# EAGLE design nixie_main_controller_board_0.2.3 (EAGLE 6.5.0)
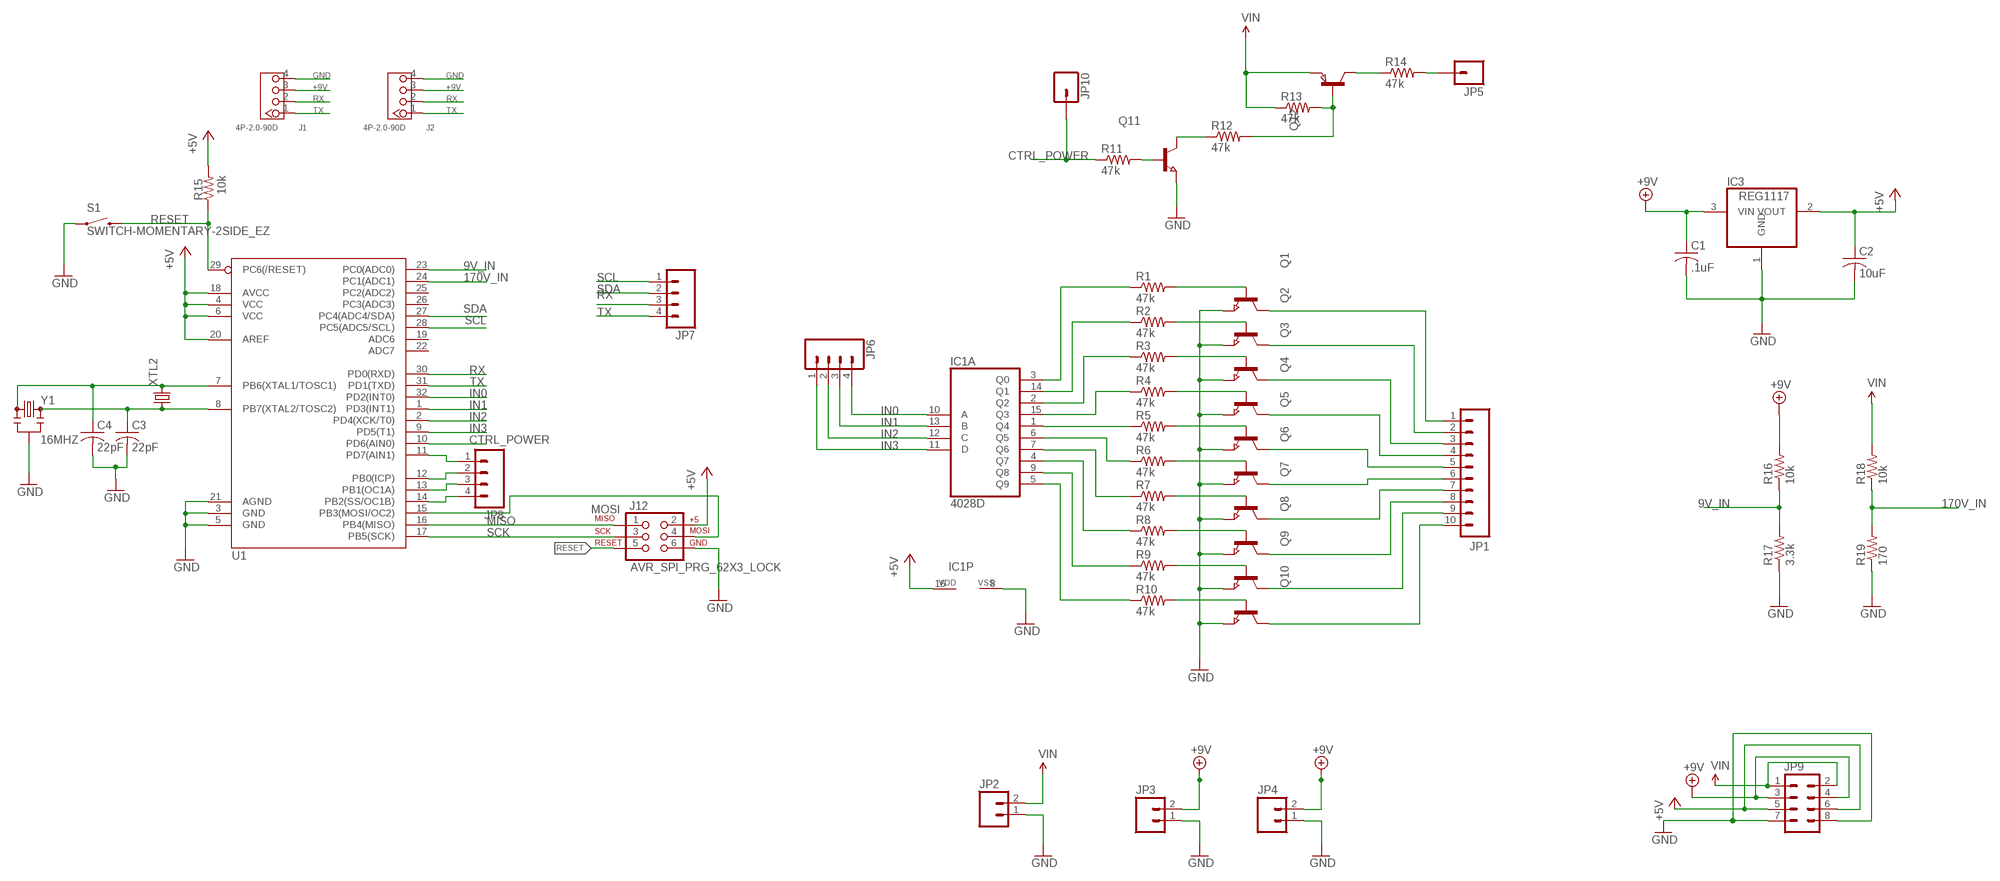
[diagram p0: schematic, sheet 1]

## Parts
C1  .1uF  C-USC0603  [C0603]
C2  10uF  C-USC0805  [C0805]
C3  22pF  C-USC0603  [C0603]
C4  22pF  C-USC0603  [C0603]
IC1  4028D  [SO16]
IC3  REG1117  [SOT223]
J1  4P-2.0-90D  GROVE-CONNECTOR-DIP-90D(4P-2.0)  [HW4-2.0-90D]
J2  4P-2.0-90D  GROVE-CONNECTOR-DIP-90D(4P-2.0)  [HW4-2.0-90D]
J12  AVR_SPI_PRG_62X3_LOCK  [2X3_LOCK]
JP1  M10LOCK  [1X10_LOCK]
JP2  M02LOCK  [1X02_LOCK]
JP3  M02LOCK  [1X02_LOCK]
JP4  M02LOCK  [1X02_LOCK]
JP5  M01PTH  [1X01]
JP6  M04PTH  [1X04]
JP7  M04PTH  [1X04]
JP8  M04PTH  [1X04]
JP9  M04X2  [2X4]
JP10  M01PTH  [1X01]
Q1  NPN-TRANSISTOR_SOT23  [SOT23]
Q2  NPN-TRANSISTOR_SOT23  [SOT23]
Q3  NPN-TRANSISTOR_SOT23  [SOT23]
Q4  NPN-TRANSISTOR_SOT23  [SOT23]
Q5  NPN-TRANSISTOR_SOT23  [SOT23]
Q6  NPN-TRANSISTOR_SOT23  [SOT23]
Q7  NPN-TRANSISTOR_SOT23  [SOT23]
Q8  NPN-TRANSISTOR_SOT23  [SOT23]
Q9  NPN-TRANSISTOR_SOT23  [SOT23]
Q10  NPN-TRANSISTOR_SOT23  [SOT23]
Q11  NPN-TRANSISTOR_SOT23  [SOT23]
Q12  PNP-TRANSISTOR_SOT23  [SOT23]
R1  47k  R-US_R0603  [R0603]
R2  47k  R-US_R0603  [R0603]
R3  47k  R-US_R0603  [R0603]
R4  47k  R-US_R0603  [R0603]
R5  47k  R-US_R0603  [R0603]
R6  47k  R-US_R0603  [R0603]
R7  47k  R-US_R0603  [R0603]
R8  47k  R-US_R0603  [R0603]
R9  47k  R-US_R0603  [R0603]
R10  47k  R-US_R0603  [R0603]
R11  47k  R-US_R0603  [R0603]
R12  47k  R-US_R0603  [R0603]
R13  47k  R-US_R0603  [R0603]
R14  47k  R-US_R0603  [R0603]
R15  10k  RESISTOR0603-RES  [0603]
R16  10k  R-US_R0603  [R0603]
R17  3.3k  R-US_R0603  [R0603]
R18  10k  R-US_R0603  [R0603]
R19  170  R-US_M1206  [M1206]
S1  SWITCH-MOMENTARY-2SIDE_EZ  [TACTILE-PTH-SIDEEZ]
U1  ATMEGA328_SMT  [TQFP32-08]
XTL2  CRYSTALHC49S  [HC49/S]
Y1  16MHZ  RESONATOR16MHZ  [RESONATOR-SMD]

## Nets
9V_IN: R16.1 R17.2 U1.23(PC0(ADC0))
170V_IN: R18.1 R19.2 U1.24(PC1(ADC1))
+5V: C2.1 IC1.16(P:VDD) IC3.2(VOUT) J12.2 JP9.5 JP9.6 R15.2 U1.4(VCC) U1.6(VCC) U1.18(AVCC) U1.20(AREF)
+9V: C1.1 IC3.3(VIN) J1.3 J2.3 JP3.2 JP4.2 JP9.3 JP9.4 R16.2
CTRL_POWER: JP10.1 R11.1 U1.10(PD6(AIN0))
GND: C1.2 C2.2 C3.2 C4.2 IC1.8(P:VSS) IC3.1(GND) J1.4 J2.4 J12.6 JP2.1 JP3.1 JP4.1 JP9.7 JP9.8 Q1.2(E) Q2.2(E) Q3.2(E) Q4.2(E) Q5.2(E) Q6.2(E) Q7.2(E) Q8.2(E) Q9.2(E) Q10.2(E) Q11.2(E) R17.1 R19.1 S1.1 U1.3(GND) U1.5(GND) U1.21(AGND) Y1.2
IN0: IC1.10(A:A) JP6.4 U1.32(PD2(INT0))
IN1: IC1.13(A:B) JP6.3 U1.1(PD3(INT1))
IN2: IC1.12(A:C) JP6.2 U1.2(PD4(XCK/T0))
IN3: IC1.11(A:D) JP6.1 U1.9(PD5(T1))
MISO: J12.1 U1.16(PB4(MISO))
MOSI: J12.4 U1.15(PB3(MOSI/OC2))
N$1: IC1.3(A:Q0) R1.1
N$2: Q1.1(B) R1.2
N$3: IC1.14(A:Q1) R2.1
N$4: IC1.2(A:Q2) R3.1
N$5: Q2.1(B) R2.2
N$6: Q3.1(B) R3.2
N$7: Q4.1(B) R4.2
N$8: Q5.1(B) R5.2
N$9: Q6.1(B) R6.2
N$10: Q7.1(B) R7.2
N$11: Q8.1(B) R8.2
N$12: Q9.1(B) R9.2
N$13: Q10.1(B) R10.2
N$14: IC1.15(A:Q3) R4.1
N$15: IC1.1(A:Q4) R5.1
N$16: IC1.5(A:Q9) R10.1
N$17: IC1.9(A:Q8) R9.1
N$18: IC1.4(A:Q7) R8.1
N$19: IC1.7(A:Q6) R7.1
N$20: IC1.6(A:Q5) R6.1
N$21: JP1.1 Q1.3(C)
N$22: JP1.2 Q2.3(C)
N$23: JP1.3 Q3.3(C)
N$24: JP1.4 Q4.3(C)
N$25: JP1.5 Q5.3(C)
N$26: JP1.6 Q6.3(C)
N$27: JP1.7 Q7.3(C)
N$28: JP1.8 Q8.3(C)
N$29: JP1.9 Q9.3(C)
N$30: JP1.10 Q10.3(C)
N$31: C4.1 U1.7(PB6(XTAL1/TOSC1)) XTL2.2 Y1.1
N$32: C3.1 U1.8(PB7(XTAL2/TOSC2)) XTL2.1 Y1.3
N$33: Q11.1(B) R11.2
N$34: Q11.3(C) R12.1
N$35: JP8.1 U1.11(PD7(AIN1))
N$36: JP8.2 U1.12(PB0(ICP))
N$37: Q12.1(B) R12.2 R13.2
N$38: Q12.3(C) R14.1
N$39: JP5.1 R14.2
N$40: JP8.3 U1.13(PB1(OC1A))
N$41: JP8.4 U1.14(PB2(SS/OC1B))
RESET: J12.5 R15.1 S1.2 U1.29(PC6(/RESET))
RX: J1.2 J2.2 JP7.3 U1.30(PD0(RXD))
SCK: J12.3 U1.17(PB5(SCK))
SCL: JP7.1 U1.28(PC5(ADC5/SCL))
SDA: JP7.2 U1.27(PC4(ADC4/SDA))
TX: J1.1 J2.1 JP7.4 U1.31(PD1(TXD))
VIN: JP2.2 JP9.1 JP9.2 Q12.2(E) R13.1 R18.2
Unconnected: U1.19(ADC6) U1.22(ADC7) U1.25(PC2(ADC2)) U1.26(PC3(ADC3))

## Library data of the parts
C1-C4 = rcl:C-US: CAPACITOR, American symbol
IC1 = 40xx:4028: BCD to decimal DECODER
IC3 = burr-brown:REG1117: 800mA and 1A Low Dropout (LDO) Positive Regulator 1.8V, 2.5V, 2.85V, 3.3V, 5V, and Adj; MPN: REG1117; OC_FARNELL: 1097566; OC_NEWARK: 14P6981
J1 J2 = Seeed-OPL-Connector:GROVE-CONNECTOR-DIP-90D(4P-2.0): 320110034
J12 = zz My Parts:AVR_SPI_PRG_6: AVR ISP 6 Pin This is the reduced ISP connector for AVR programming. Common on Arduino. This footprint will take up less PCB space and can be used with a 10-pin to 6-pin adapter such as SKU: BOB-08508
JP1 = SparkFun-Connectors:M10: Header 10 Standard 10-pin 0.1" header. Use with straight break away headers (SKU : PRT-00116), right angle break away headers (PRT-00553), swiss pins (PRT-00743), machine pins (PRT-00117), and female headers (PRT-00115).
JP2-JP4 = SparkFun-Connectors:M02: Standard 2-pin 0.1" header. Use with - straight break away headers ( PRT-00116) - right angle break away headers (PRT-00553) - swiss pins (PRT-00743) - machine pins (PRT-00117) - female headers (PRT-00115) Molex polarized connector foot print use with: PRT-08233 with associated crimp pins and housings. 2.54_SCREWTERM for use with PRT-10571. 3.5mm Screw Terminal footprints for PRT-08084 5mm Screw Terminal footprints for use with PRT-08432
JP5 JP10 = SparkFun-Connectors:M01: Header 1 Standard 1-pin 0.1" header. Use with straight break away headers (SKU : PRT-00116), right angle break away headers (PRT-00553), swiss pins (PRT-00743), machine pins (PRT-00117), and female headers (PRT-00115).
JP6-JP8 = SparkFun-Connectors:M04: Header 4 Standard 4-pin 0.1" header. Use with straight break away headers (SKU : PRT-00116), right angle break away headers (PRT-00553), swiss pins (PRT-00743), machine pins (PRT-00117), and female headers (PRT-00115). Molex polarized connector foot print use with SKU : PRT-08231 with associated crimp pins and housings. 1MM SMD Version SKU: PRT-10208
JP9 = SparkFun-Connectors:M04X2: .1" header, two rows of four.
Q1-Q11 = semicon-smd-ipc:NPN-TRANSISTOR_: NPN TRANSISTOR
Q12 = semicon-smd-ipc:PNP-TRANSISTOR_: PNP TRANSISTOR
R1-R14 R16-R18 = rcl:R-US_: RESISTOR, American symbol
R15 = zz My Parts:RESISTOR: Resistor Basic schematic elements and footprints for resistors. 0603 and 0805 are mine.
R19 = adafruit:R-US_: RESISTOR, American symbol
S1 = SparkFun-Electromechanical:SWITCH-MOMENTARY-2: Various NO switches- pushbuttons, reed, etc
U1 = SparkFun-DigitalIC:ATMEGA328_SMT: 32-Pin Atmega328 part Commonly used on Arduino compatible boards Available in QFP and QFN packages TQFP is IC-09069 QFN is non-stock; PROD_ID: IC-09069; VALUE: ATMEGA328P
XTL2 = crystal:CRYSTAL: CRYSTAL; OC_FARNELL: 1667008; OC_NEWARK: unknown
Y1 = SparkFun-FreqCtrl:RESONATOR: Resonator Small SMD resonator. Used, eg, on the Arduino Pro/ Pro Mini boards. 8MHz- XTAL-08895 16MHz- XTAL-08900; PROD_ID: XTAL-08900

## Net classes
0 default: width 0.203 mm

## Board
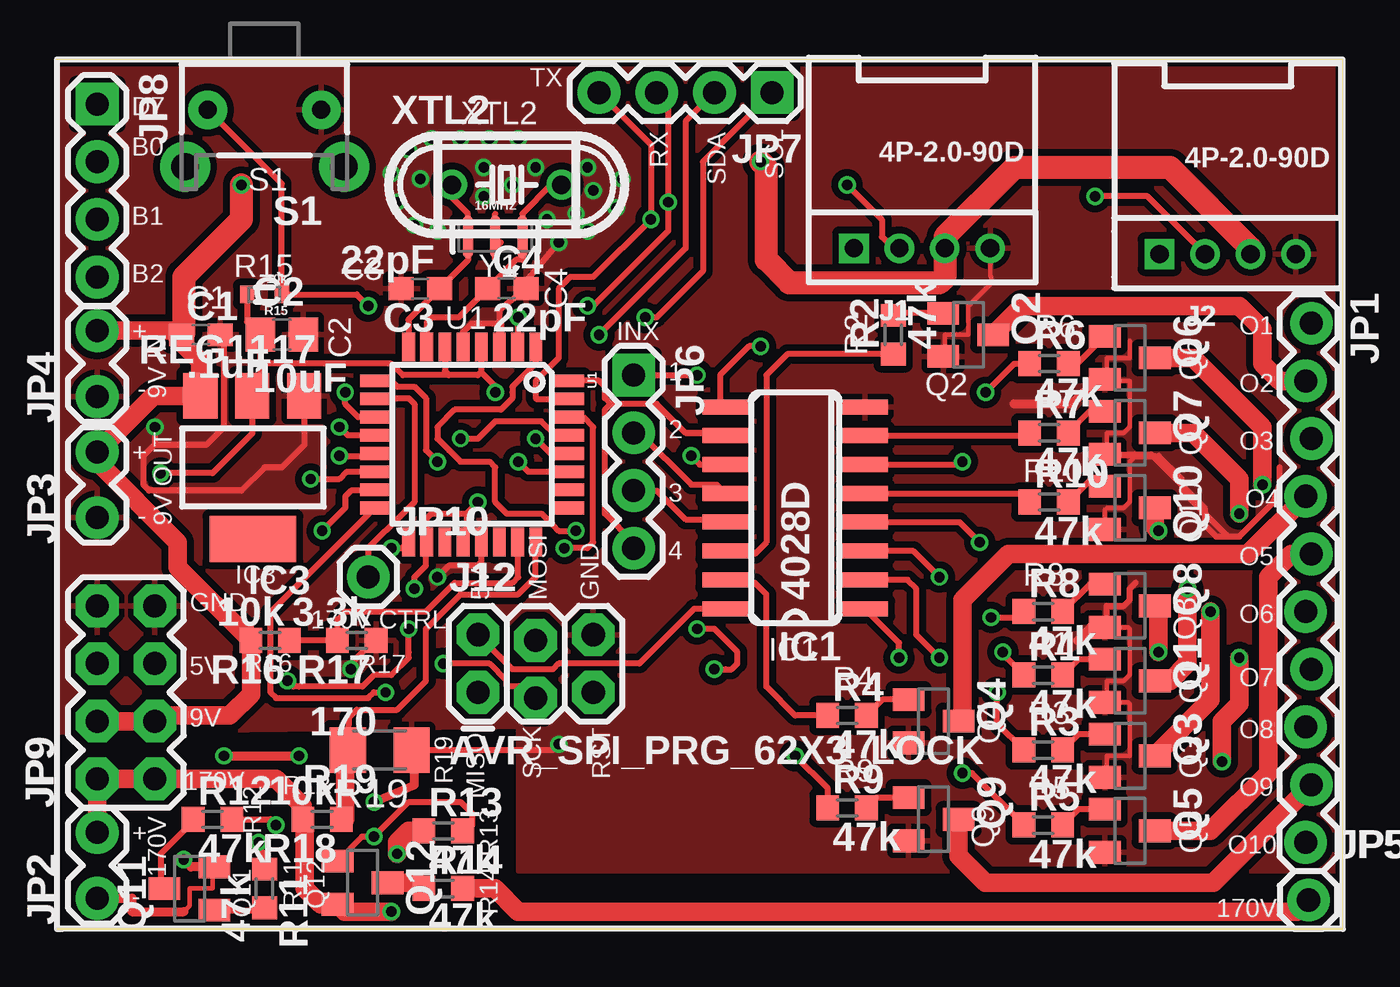
[diagram p1: board, top side]
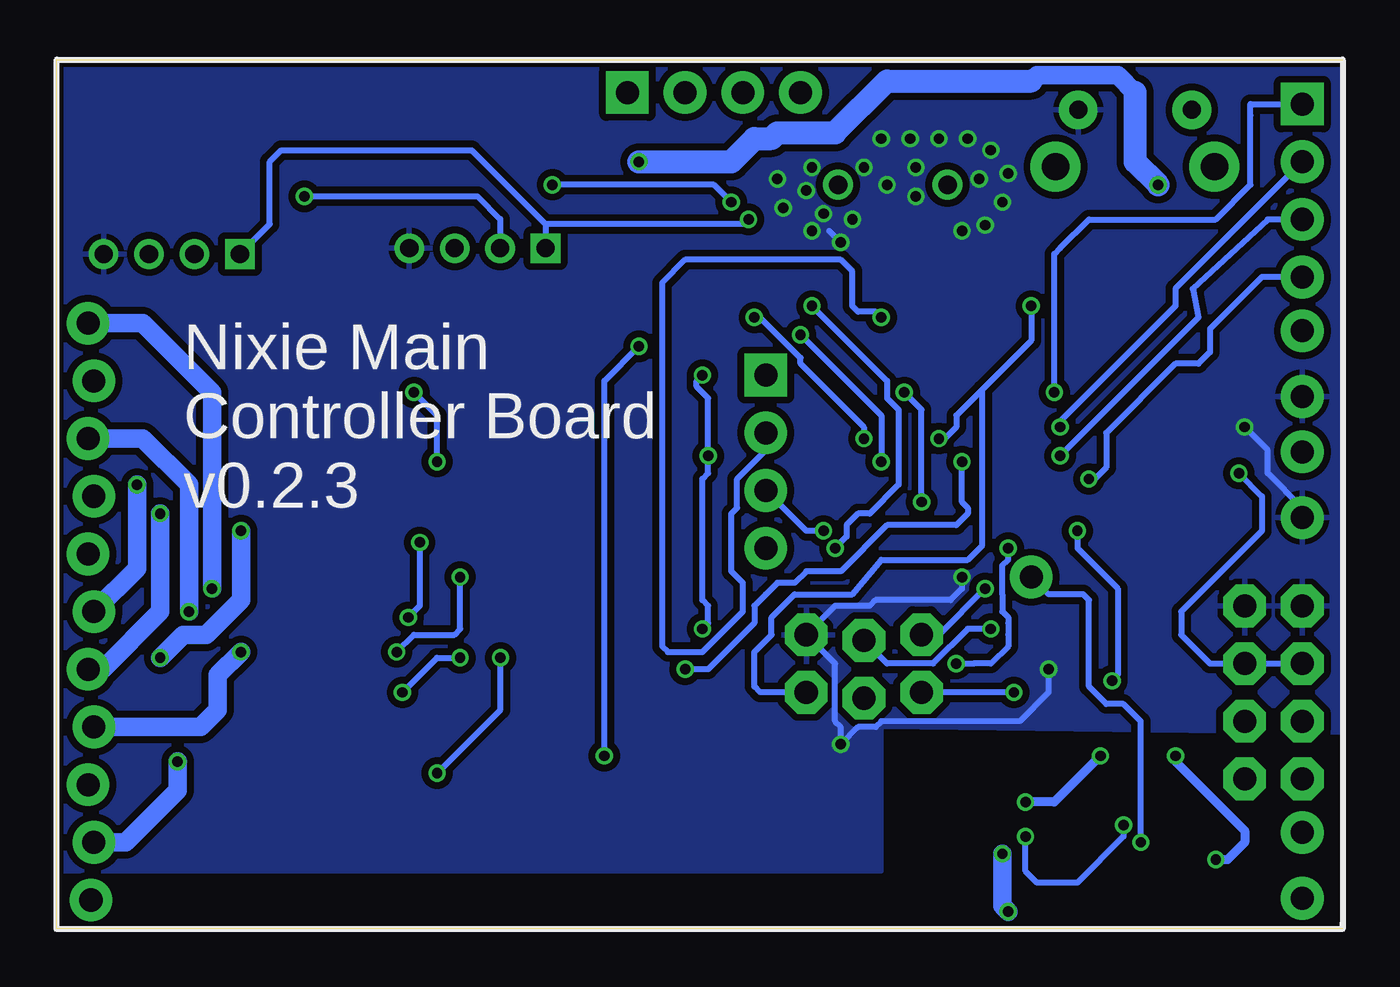
[diagram p2: board, bottom side, seen from below]

Size 56.62 x 38.28 mm. Coordinates in mm from the lower left corner, seen from the top.
Outline: 56.62,0 56.62,38.28 0,38.28
Copper layers (1*16): Top 0.035mm / dielectric 1.5mm / Bottom 0.035mm
Design rules "SeeedStudio_2layer_DRU_no_angle_20140221": minimum track width 6mil, minimum drill 12mil, track to track 6mil, track to pad 6mil, pad to pad 6mil, via to via 6mil, smd to smd 0mil, copper to edge 10mil, drill to drill 10mil, minimum pad ring 10mil, minimum via ring 6mil, stop-mask expansion 2mil, vias tented up to drill 100mil, thermal gap 10mil

### Footprints (pad centres in the part's own frame; a part is rotated, then mirrored left to right if it is on the bottom)
C0603 = smd 1.1 x 1: 1 -0.85,0; 2 0.85,0
C0805 = smd 1.3 x 1.5: 1 -0.95,0; 2 0.95,0
SO16 = smd 0.66 x 2.032: 1 -4.445,-3.073; 2 -3.175,-3.073; 3 -1.905,-3.073; 4 -0.635,-3.073; 5 0.635,-3.073; 6 1.905,-3.073; 7 3.175,-3.073; 8 4.445,-3.073; 9 4.445,3.073; 10 3.175,3.073; 11 1.905,3.073; 12 0.635,3.073; 13 -0.635,3.073; 14 -1.905,3.073; 15 -3.175,3.073; 16 -4.445,3.073
SOT223 = smd 1.499 x 2.007: 1 -2.261,-3.15; 2 0.025,-3.15; 3 2.311,-3.15 | smd 3.81 x 2.007: 4 0,3.15
HW4-2.0-90D = drill 0.8 pad 1.27 square: 1 -3,0 | drill 0.8 pad 1.27: 2 -1,0; 3 1,0; 4 3,0
2X3_LOCK = drill 1.016 pad 1.88 octagon: 1 0,0; 2 0,2.54; 3 2.54,-0.254; 4 2.54,2.286; 5 5.08,0; 6 5.08,2.54
1X10_LOCK = drill 1.016 pad 1.88: 1 0,0.127; 2 2.54,-0.127; 3 5.08,0.127; 4 7.62,-0.127; 5 10.16,0.127; 6 12.7,-0.127; 7 15.24,0.127; 8 17.78,-0.127; 9 20.32,0.127; 10 22.86,-0.127
1X02_LOCK = drill 1.016 pad 1.88: 1 -0.178,0; 2 2.718,0
1X01 = drill 1.016 pad 1.88: 1 0,0
1X04 = drill 1.016 pad 1.88 square: 1 0,0 | drill 1.016 pad 1.88: 2 2.54,0; 3 5.08,0; 4 7.62,0
2X4 = drill 1.016 pad 1.88 octagon: 1 -3.81,-1.27; 2 -3.81,1.27; 3 -1.27,-1.27; 4 -1.27,1.27; 5 1.27,-1.27; 6 1.27,1.27; 7 3.81,-1.27; 8 3.81,1.27
SOT23 = smd 1 x 1.4: 1 -0.95,-1.1; 2 0.95,-1.1; 3 0,1.1
R0603 = smd 1 x 1.1: 1 -0.85,0; 2 0.85,0
0603 = smd 0.635 x 0.762: 1 -0.762,0; 2 0.762,0
M1206 = smd 1.6 x 2: 1 -1.4,0; 2 1.4,0
TACTILE-PTH-SIDEEZ = drill 0.8 pad 1.7: 1 -2.5,0; 2 2.5,0 | drill 1.2 pad 2.2: ANCHOR1 -3.5,2.5; ANCHOR2 3.5,2.5
TQFP32-08 = smd 1.27 x 0.559: 1 -4.293,2.8; 2 -4.293,2; 3 -4.293,1.2; 4 -4.293,0.4; 5 -4.293,-0.4; 6 -4.293,-1.2; 7 -4.293,-2; 8 -4.293,-2.8; 17 4.293,-2.8; 18 4.293,-2; 19 4.293,-1.2; 20 4.293,-0.4; 21 4.293,0.4; 22 4.293,1.2; 23 4.293,2; 24 4.293,2.8 | smd 0.559 x 1.27: 9 -2.8,-4.293; 10 -2,-4.293; 11 -1.2,-4.293; 12 -0.4,-4.293; 13 0.4,-4.293; 14 1.2,-4.293; 15 2,-4.293; 16 2.8,-4.293; 25 2.8,4.293; 26 2,4.293; 27 1.2,4.293; 28 0.4,4.293; 29 -0.4,4.293; 30 -1.2,4.293; 31 -2,4.293; 32 -2.8,4.293
HC49/S = drill 0.813: 1 -2.413,0; 2 2.413,0
RESONATOR-SMD = smd 0.45 x 1.905: 1 -1.2,0; 2 0,0; 3 1.2,0

### Placement (x,y rotation side)
C1  6.35,26.16 0 top
C2  9.91,26.16 0 top
C3  16,28.19 180 top
C4  19.81,28.19 0 top
IC1  32.51,18.54 90 top
IC3  8.64,20.32 180 top
J1  38.1,29.97 0 top
J2  51.56,29.72 0 top
J12  18.54,10.41 0 top
JP1  55.12,26.67 270 top
JP2  1.78,1.52 90 top
JP3  1.78,18.29 90 top
JP4  1.78,23.62 90 top
JP5  55.12,1.27 0 top
JP6  25.4,24.38 270 top
JP7  31.5,36.83 180 top
JP8  1.78,36.32 270 top
JP9  3.05,10.41 90 top
JP10  13.72,15.49 0 top
Q1  47.24,10.92 270 top
Q2  40.13,26.16 270 top
Q3  47.24,7.62 270 top
Q4  38.61,9.14 270 top
Q5  47.24,4.32 270 top
Q6  47.24,25.15 270 top
Q7  47.24,21.84 270 top
Q8  47.24,14.22 270 top
Q9  38.61,4.83 270 top
Q10  47.24,18.54 270 top
Q11  5.84,1.78 90 top
Q12  13.46,2.03 270 top
R1  43.43,11.18 0 top
R2  36.83,26.16 90 top
R3  43.43,7.87 0 top
R4  34.8,9.4 0 top
R5  43.43,4.57 0 top
R6  43.69,24.89 0 top
R7  43.69,21.84 0 top
R8  43.43,13.97 0 top
R9  34.8,5.33 0 top
R10  43.69,18.8 0 top
R11  9.14,1.78 270 top
R12  6.86,4.83 0 top
R13  17.02,4.32 0 top
R14  17.02,1.78 0 top
R15  9.14,27.94 180 top
R16  9.4,12.7 180 top
R17  13.21,12.7 180 top
R18  11.68,4.83 180 top
R19  14.22,7.87 180 top
S1  9.14,36.07 180 top
U1  18.29,21.34 270 top
XTL2  19.81,32.77 0 top
Y1  19.3,30.48 180 top

### Tracks (layer width: path | path; a pad name or v marks a point on that pad's centre or on a via)
9V_IN
  Top 0.254: R16.1 R17.2 12.36,13.63 12.7,13.97 16.26,13.97 17.53,15.24 20.07,15.24 20.32,15.49 20.32,17.01 U1.23
170V_IN
  Top 0.254: R18.1 12.7,4.83 | R19.2 12.87,9.31 13.21,9.65 14.99,9.65 16.26,10.92 16.26,13.21 17.78,14.73 20.32,14.73 20.83,15.24 21.08,15.49 U1.24
  Top 0.813: 12.7,4.83 12.7,7.79 R19.2
+5V  (via drill 0.46)
  Top 0.254: R15.2 8.38,26.74 C2.1 8.96,24.64 | 8.96,24.64 8.96,23.82 IC3.2 8.61,21.82 6.86,20.07 v4.57,20.07 | U1.4 18.69,24.53 | 18.69,24.53 18.54,24.38 17.27,24.38 | v18.54,18.8 18.03,18.29 | 18.03,18.29 18.03,17.19 U1.20 | 18.03,18.29 16.51,18.29 16.29,18.07 U1.18 16.26,17.01 16.26,16 15.75,15.49 v15.75,14.99 | v19.3,23.62 19.3,23.91 18.69,24.53 | U1.6 17.09,24.57 17.27,24.38 | 17.27,24.38 15.24,24.38 14.73,24.89 9.21,24.89 8.96,24.64 | J12.2 20.07,11.43 21.84,11.43 22.1,11.68 25.65,11.68 28.07,14.1 IC1.16
  Bottom 0.254: v4.57,20.07 3.56,19.05 3.56,17.53 7.11,13.97 7.11,12.95 5.84,11.68 JP9.5 JP9.6 | v18.54,18.8 18.54,22.86 v19.3,23.62 | J12.2 17.78,12.95 v15.75,14.99
+9V  (via drill 0.46)
  Top 0.254: R16.2 8.55,13.3 | 6.2,23.47 IC3.3 6.33,24.16 | 5.33,26 C1.1 5.32,26.34
  Top 0.813: JP4.2 5.5,26.34 C1.1 | 5.33,26 6.33,25 IC3.3 | 6.2,23.47 4.24,23.47 JP3.2 1.78,20.57 5.33,17.02 5.33,15.91 R16.2 8.55,10.33 7.62,9.4 4.57,9.4 JP9.3 JP9.4
  Top 1.016: J2.3 52.56,29.99 49.02,33.53 42.16,33.53 39.12,30.48 39.12,29.99 J1.3 39.1,28.69 38.86,28.45 32.26,28.45 31.24,29.46 31.24,33.53 v30.99,33.78 | v8.13,32.77 8.13,31.24 5.59,28.7 5.59,26.25 C1.1
  Bottom 0.813: 9.14,36.83 9.91,37.59 13.46,37.59 13.72,37.34
  Bottom 1.016: v30.99,33.78 26.92,33.78 25.91,34.8 25.15,34.8 24.89,35.05 22.35,35.05 20.07,37.34 13.72,37.34 | 9.14,36.83 9.14,33.78 v8.13,32.77
CTRL_POWER  (via drill 0.46)
  Top 0.254: R11.1 9.14,3.3 8.89,3.56 v8.89,3.81 | U1.10 13.97,23.37 15.49,23.37 15.75,23.11 15.75,18.8 15.24,18.29 13.72,16.76 JP10.1
  Bottom 0.254: v8.89,3.81 8.89,9.14 9.65,9.91 10.41,9.91 11.18,10.67 11.18,14.48 11.43,14.73 12.95,14.73 JP10.1
GND  (via drill 0.46)
  Top 0.203: 47.24,25.91 47.24,25.15 46.23,25.15 46.23,24.28 Q6.2 46.08,24.13 | 46.08,24.13 45.97,24.13 | 46.08,24.13 47.24,24.13 47.24,22.1 46.99,21.84 46.23,21.84 46.23,20.98 Q7.2 46.21,20.83 47.5,20.83 47.24,20.57 47.24,18.8 46.99,18.54 46.23,18.54 46.14,18.46 Q10.2 46.21,17.53 46.23,17.53 | Q2.2 39.12,25.3 39.12,26.16 40.13,26.16 40.13,27.43 41.15,28.45 41.15,28.7 41.1,28.75 J1.4 | Q8.2 47.18,13.27 47.24,13.21 47.24,11.18 46.99,10.92 46.23,10.92 46.23,10.06 Q1.2 47.18,9.97 47.24,9.91 47.24,7.62 46.23,7.62 46.23,6.75 Q3.2 | 5.59,0.76 5.84,1.02 5.84,1.78 6.86,1.78 6.86,2.64 Q11.2
  Top 0.254: 46.23,13.46 46.23,14.22 46.99,14.22 47.24,14.48 47.24,14.99 47.5,15.24 | 51.56,17.27 49.53,19.3 49.53,19.81 48.51,20.83 47.5,20.83 47.43,20.89 Q7.2 48.19,20.89 50.55,18.54 50.55,17.78 51.05,17.27 52.07,17.27 53.59,18.8 53.85,19.56 53.85,20.32 | U1.21 18.69,16.15 18.54,16 17.27,16 v16.76,15.49 | 46.21,17.53 46.21,17.51 | 46.21,17.51 45.97,17.27 | 46.21,17.51 46.23,17.53 | IC3.1 10.9,21.31 9.91,20.32 9.14,20.32 8.13,19.3 4.06,19.3 3.81,19.56 3.81,20.83 4.32,21.34 | 4.32,21.34 6.6,21.34 7.37,22.1 7.37,26 C1.2 | U1.5 17.89,26.27 18.29,26.67 19.56,26.67 19.56,25.7 U1.3 19.49,27.27 C4.2 | 20.57,28.19 C4.2 | C4.2 20.83,28.19 | 19.3,29.46 19.3,29.97 19.56,30.23 | C4.2 20.66,28.54 v22.1,30.23 | R19.1 15.75,7.87 21.84,7.87 v22.1,8.13 | 13.97,12.7 12.95,11.68 v12.95,11.43 | v4.32,22.1 4.32,21.34
  Top 0.406: Q6.2 45.79,24.2 44.7,23.11 42.16,23.11 | 44.96,12.7 45.53,13.27 Q8.2 46.14,13.38 46.23,13.46 | JP2.1 3.3,1.35 3.3,0.76 5.59,0.76 | R17.1 13.97,12.7 | R19.1 15.49,7.71 | Q11.2 5.91,2.73 v5.59,3.05 | v7.37,7.62 v10.67,7.62 | v13.97,5.59 15.75,6.35 15.75,7.87
  Bottom 0.254: v16.76,15.49 16.76,14.99 17.27,14.48 20.57,14.48 20.83,14.22 22.35,14.22 J12.6 22.35,11.68 22.35,9.14 22.1,8.89 v22.1,8.13 21.34,8.89 20.57,8.89 20.32,9.14 14.22,9.14 12.95,10.41 v12.95,11.43 | v22.1,30.23 22.61,30.73 | JP3.1 1.78,18.54 3.3,20.07 3.3,21.08 v4.32,22.1
  Bottom 0.406: v7.37,7.62 7.37,7.37 4.32,4.32 4.32,3.81 5.08,3.05 v5.59,3.05 | v10.67,7.62 12.7,5.59 v13.97,5.59
  other vias: 23.37,30.73 24.64,31.75 24.89,33.02 20.32,34.8 19.05,34.8 17.78,34.8 16.51,34.8 15.49,34.29 14.73,33.27 14.99,32 15.75,30.99 16.76,30.73 20.07,32.77 16,33.02 21.08,33.53 18.8,33.53 18.8,32.26 21.59,31.24 22.86,31.5 23.62,32.51 23.37,33.53
  pour Bottom (isolate 0.305): 0,38.35 56.64,38.35 56.64,2.54 20.32,2.54 20.32,8.89 0,8.64
  pour Top (isolate 0.305): 0,38.35 56.64,38.35 56.64,2.54 20.32,2.54 20.32,8.89 0,8.64
IN0
  Top 0.254: IC1.10 29.31,21.84 29.21,21.84 | 29.21,21.84 27.69,21.84 | 27.69,21.84 26.42,23.11 24.64,23.11 24.38,23.11 | 27.69,21.84 29.21,21.84 | 29.21,21.84 28.96,21.59 29.46,21.59 29.72,21.84 | 24.38,23.11 24.13,23.37 24.13,23.88 23.87,24.14 U1.32 | JP6.4 25.4,17.02 24.13,18.29 24.13,22.86 24.38,23.11
IN1  (via drill 0.46)
  Top 0.254: JP6.3 26.42,19.3 27.69,18.03 29.31,18.03 IC1.13 | U1.1 21.09,25.15 21.09,24.9 21.08,24.89 20.07,23.88 20.07,23.62 20.07,23.37 19.56,22.86 17.53,22.86 16.76,22.1 16.76,21.59 17.27,21.08 17.78,20.57 19.05,20.57 19.3,20.32 19.3,18.8 19.81,18.29 21.34,18.29 21.84,17.78 22.1,17.53 v22.86,17.53
  Bottom 0.254: JP6.3 23.88,17.78 23.62,17.53 v22.86,17.53
IN2  (via drill 0.46)
  Top 0.254: JP6.2 25.65,21.84 27.94,19.56 29.06,19.56 IC1.12 29.31,19.3 29.21,19.3 | U1.2 20.32,25.66 v20.32,26.92
  Bottom 0.254: v20.32,26.92 20.57,27.18 21.34,27.18 21.59,27.43 21.59,28.96 22.1,29.46 28.96,29.46 29.97,28.45 29.97,12.45 29.72,12.19 28.19,12.19 26.42,13.97 26.42,14.48 26.42,15.24 26.92,15.75 26.92,18.29 26.67,18.54 26.67,19.81 25.4,21.08 JP6.2
IN3  (via drill 0.46)
  Top 0.254: JP6.1 v28.19,24.38 | 28.32,20.45 v27.94,20.83 28.32,20.45 | 28.32,20.45 IC1.11 | U1.9 14.73,24.14 14.99,23.88 15.75,23.88 16.26,23.37 16.26,21.08 v16.76,20.57 | 28.32,20.45 28.57,20.45 28.7,20.32 | v28.96,11.43 29.46,11.43 29.72,11.43 29.97,11.68 29.97,12.19 28.96,13.21 v28.19,13.21
  Bottom 0.254: v28.19,24.38 28.45,24.13 28.45,23.88 27.94,23.37 27.94,21.08 v27.94,20.83 27.94,20.07 28.19,19.81 28.19,14.48 27.94,14.22 27.94,13.46 v28.19,13.21 | v28.96,11.43 27.94,11.43 25.91,13.46 25.91,14.22 25.4,14.73 24.89,15.24 24.38,15.24 24.13,15.24 23.62,15.75 23.11,15.75 22.1,15.75 20.07,17.78 17.02,17.78 16.51,18.29 16.51,18.54 16.76,18.8 v16.76,20.57
MISO  (via drill 0.46)
  Top 0.254: U1.16 9.4,13.94 9.4,10.41 9.65,10.16 13.72,10.16 13.97,10.41 v14.48,10.41
  Bottom 0.254: v14.48,10.41 17.78,10.41 18.03,10.41 J12.1
MOSI  (via drill 0.46)
  Top 0.254: U1.15 14.03,19.3 14.22,19.3 13.97,19.3 13.46,19.3 12.95,19.3 12.7,19.05 12.7,18.54 12.19,18.03 v11.68,17.53 | v15.49,13.21 15.49,12.19 15.49,11.94 14.73,11.18 13.97,11.18 13.46,10.67 10.67,10.67 10.41,10.67 v10.16,10.92
  Bottom 0.254: v11.68,17.53 11.68,16.76 9.91,14.99 9.91,11.18 v10.16,10.92 | v15.49,13.21 16.51,13.21 18.03,11.68 20.07,11.68 J12.4
N$1  (via drill 0.46)
  Top 0.254: R1.1 41.66,12.1 v41.66,12.19 | v38.86,15.49 37.72,16.64 IC1.3
  Bottom 0.254: v41.66,12.19 40.89,12.95 39.12,12.95 38.86,13.21 v38.86,15.49
N$2
  Top 0.254: Q1.1 44.98,11.87 R1.2
N$3
  Top 0.254: R2.1 32.17,25.31 31.24,24.38 31.24,17.02 30.73,16.51 29.57,16.51 IC1.14
N$4  (via drill 0.46)
  Top 0.254: R3.1 41.4,9.06 v41.4,10.41 | v38.86,11.94 37.85,12.95 37.85,14.99 37.47,15.37 IC1.2
  Bottom 0.254: v41.4,10.41 39.88,11.94 v38.86,11.94
N$5
  Top 0.254: Q2.1 36.93,27.11 R2.2
N$6
  Top 0.254: Q3.1 44.98,8.57 R3.2
N$7
  Top 0.254: Q4.1 36.34,10.09 R4.2
N$8
  Top 0.254: Q5.1 44.98,5.27 R5.2
N$9
  Top 0.254: R6.2 44.94,24.89 Q6.1
N$10
  Top 0.254: Q7.1 45.49,22.79 R7.2
N$11
  Top 0.254: Q8.1 45.49,15.17 R8.2
N$12
  Top 0.254: Q9.1 36.09,5.78 R9.2
N$13
  Top 0.254: Q10.1 45.49,19.75 R10.2
N$14
  Top 0.254: R4.1 32.51,9.4 31.24,10.67 31.24,14.73 30.73,15.24 29.57,15.24 IC1.15
N$15  (via drill 0.46)
  Top 0.254: R5.1 40.3,6.86 v39.88,6.86 | v37.08,11.94 37.08,12.6 IC1.1
  Bottom 0.254: v39.88,6.86 37.08,9.65 v37.08,11.94
N$16
  Top 0.254: IC1.5 42.46,19.18 R10.1
N$17  (via drill 0.46)
  Top 0.254: R9.1 33.95,6.18 v32.51,7.62 | v30.99,25.65 30.48,25.65 29.21,24.38 29.21,23.22 IC1.9
  Bottom 0.254: v32.51,7.62 32.51,24.13 v30.99,25.65
N$18  (via drill 0.46)
  Top 0.254: IC1.4 39.75,17.91 v40.64,17.02 | v41.15,13.72 42.33,13.72 R8.1
  Bottom 0.254: v40.64,17.02 40.64,14.22 v41.15,13.72
N$19
  Top 0.254: IC1.7 42.71,21.72 R7.1
N$20  (via drill 0.46)
  Top 0.254: IC1.6 39.75,20.45 v39.88,20.57 | v40.89,23.62 42.16,24.89 R6.1
  Bottom 0.254: v39.88,20.57 39.88,22.61 v40.89,23.62
N$21  (via drill 0.46)
  Top 0.813: Q1.3 49.02,10.92 49.78,11.68 v49.78,14.99
  Bottom 0.813: v49.78,14.99 49.78,23.62 52.83,26.67 JP1.1
N$22
  Top 0.813: JP1.2 53.85,24.13 53.09,24.89 53.09,26.42 52.07,27.43 43.01,27.43 42.5,27.43 Q2.3
N$23  (via drill 0.46)
  Top 0.813: Q3.3 50.8,10.08 v50.8,13.97
  Bottom 0.813: v50.8,13.97 50.8,19.56 52.83,21.59 JP1.3
N$24
  Top 0.254: 54.99,18.92 JP1.4
  Top 0.813: Q4.3 39.88,9.31 39.88,14.48 41.91,16.51 50.55,16.51 52.45,16.51 JP1.4
N$25
  Top 0.813: Q5.3 50.8,4.32 53.34,6.86 53.34,15.49 54.36,16.51 JP1.5
N$26  (via drill 0.46)
  Top 0.813: v53.09,19.56 53.09,22.1 50.29,24.89 50.04,25.15 Q6.3
  Bottom 0.813: v53.09,19.56 53.09,15.88 JP1.6
N$27  (via drill 0.46)
  Top 0.813: v52.07,18.29 52.07,19.81 50.04,21.84 Q7.3
  Bottom 0.813: JP1.7 54.61,11.43 52.07,13.97 v52.07,18.29
N$28  (via drill 0.46)
  Top 0.813: Q8.3 48.51,14.05 v48.51,12.19
  Bottom 0.813: v48.51,12.19 49.53,11.18 49.53,9.65 50.29,8.89 JP1.8
N$29
  Top 0.813: Q9.3 39.71,3.22 40.89,2.03 50.93,2.03 JP1.9
N$30  (via drill 0.46)
  Top 0.813: v51.31,7.37 51.31,9.14 52.07,9.91 v52.07,11.94 | v48.51,17.53 48.34,17.7 Q10.3
  Bottom 0.813: JP1.10 53.59,3.81 51.31,6.1 v51.31,7.37 | v52.07,11.94 51.05,12.95 50.04,12.95 48.51,14.48 v48.51,17.53
N$31
  Top 0.254: XTL2.2 21.77,32.77 20.5,31.5 | 20.5,29.46 20.23,29.46 C4.1 17.69,26.92 16.51,26.92 16.29,26.7 U1.7
N$32
  Top 0.254: XTL2.1 17.4,32.2 18.1,31.5 | 18.1,29.46 18.1,29.45 C3.1 15.49,26.83 U1.8
N$33
  Top 0.254: Q11.1 8.79,0.83 R11.2
N$34
  Top 0.254: R12.1 6.1,4.83 5.08,3.81 4.57,3.3 4.57,1.95 Q11.3
N$35  (via drill 0.46)
  Top 0.254: U1.11 13.53,22.54 13.28,22.54 12.7,23.11 v12.7,23.62
  Bottom 0.254: JP8.1 4.06,36.32 4.06,35.81 4.06,32.77 5.59,31.24 11.18,31.24 12.45,29.97 12.7,29.72 v12.7,23.62
N$36  (via drill 0.46)
  Top 0.254: v12.45,22.1 12.81,21.74 U1.12
  Bottom 0.254: JP8.2 7.37,28.19 7.37,27.43 12.45,22.35 v12.45,22.1
N$37  (via drill 0.46)
  Top 0.254: R12.2 9.4,4.83 v9.65,4.57 | R13.2 18.03,4.32 18.29,4.57 18.29,5.08 17.78,5.59 15.75,5.59 15.49,5.59 v13.97,4.06 13.44,4.06 Q12.1
  Bottom 0.254: v9.65,4.57 9.65,4.06 11.68,2.03 13.46,2.03 13.97,2.54 v13.97,4.06
N$38
  Top 0.813: R14.1 15.91,2.03 Q12.3
N$39
  Top 0.813: JP5.1 54.61,0.76 48.51,0.76 20.32,0.76 19.3,1.78 R14.2
N$40  (via drill 0.46)
  Top 0.254: v12.45,20.83 13.89,20.83 U1.13
  Bottom 0.254: JP8.3 3.3,31.24 6.6,28.19 6.35,26.92 v12.45,20.83
N$41  (via drill 0.46)
  Top 0.254: v11.18,19.81 12.45,19.81 12.77,20.14 U1.14
  Bottom 0.254: JP8.4 3.56,28.7 5.84,26.42 5.84,25.91 5.84,25.4 6.35,24.89 7.37,24.89 10.41,21.84 10.41,20.32 10.92,19.81 v11.18,19.81
RESET  (via drill 0.46)
  Top 0.254: S1.2 9.91,32.81 9.91,31.75 R15.1 13.21,27.94 v13.72,27.43 | v17.78,21.59 18.54,21.59 19.05,22.1 19.3,22.35 21.34,22.35 21.95,21.74 U1.29 22.61,21.71 22.61,21.59
  Bottom 0.254: v13.72,27.43 13.72,25.91 15.88,23.75 | 15.88,23.75 17.02,22.61 17.02,22.1 17.53,21.59 v17.78,21.59 | J12.5 25.65,10.41 25.91,10.67 25.91,12.19 25.15,12.95 25.15,13.72 24.38,14.48 24.13,14.73 21.59,14.73 20.32,16.26 16.51,16.26 15.88,16.89 15.88,23.75
RX  (via drill 0.46)
  Top 0.254: J2.2 48.02,32.26 v45.72,32.26 | JP7.3 26.92,36.32 v26.92,32 26.92,30.73 23.62,27.43 v23.37,27.43 | U1.30 23.18,22.54 23.62,22.1 23.62,17.02 23.37,16.76 v22.35,16.76 | v34.8,32.77 36.32,31.24 36.32,30.48 36.83,29.97 J1.2
  Bottom 0.254: v45.72,32.26 38.1,32.26 37.1,31.26 J1.2 | v22.35,16.76 21.84,17.27 21.84,17.78 21.34,18.29 20.83,18.29 19.56,19.56 19.56,22.86 20.07,23.37 20.07,24.13 v23.37,27.43 | v26.92,32 27.69,32.77 v34.8,32.77
SCK  (via drill 0.46)
  Top 0.254: J12.3 20.57,10.67 19.81,10.67 19.81,10.92 19.05,11.68 v17.02,11.68 | v14.73,16.76 15.21,16.76 U1.17
  Bottom 0.254: v17.02,11.68 16.26,11.68 15.49,11.68 14.73,12.45 14.73,12.95 14.73,13.46 14.73,13.72 14.99,13.97 14.99,14.73 14.99,14.99 14.99,15.49 14.99,15.75 14.99,16 14.73,16.26 v14.73,16.76
SCL  (via drill 0.46)
  Top 0.254: JP7.1 28.45,33.78 28.45,28.96 26.42,26.92 v25.91,26.92 | v21.08,21.59 21.74,20.94 U1.28
  Bottom 0.254: v21.08,21.59 21.08,22.1 23.88,24.89 23.88,25.15 25.65,26.92 v25.91,26.92
SDA  (via drill 0.46)
  Top 0.254: JP7.2 27.69,35.56 27.69,29.97 v23.88,26.16 | v20.32,20.57 20.76,20.14 U1.27
  Bottom 0.254: v23.88,26.16 20.32,22.61 v20.32,20.57
TX  (via drill 0.46)
  Top 0.254: JP7.4 26.16,34.54 v26.16,31.24 23.62,28.7 22.61,28.7 22.1,28.19 22.1,25.15 21.08,24.13 21.08,23.37 21.11,23.34 U1.31
  Bottom 0.254: J2.1 47.24,31.04 47.24,33.78 46.74,34.29 38.35,34.29 35.1,31.04 | 35.1,31.04 J1.1 | v26.16,31.24 26.37,31.04 35.1,31.04
VIN  (via drill 0.46)
  Top 0.813: JP2.2 JP9.2 JP9.1 9.65,6.6 10.83,5.42 R18.2 10.92,4.74 10.92,1.78 11.62,1.08 Q12.2 12.68,0.76 v14.73,0.76 | v14.99,3.3 14.99,3.81 15.49,4.32 R13.1
  Bottom 0.813: v14.73,0.76 14.99,1.02 14.99,3.05 v14.99,3.3

### Text on the board
tNames: JP8 | XTL2 | JP7 | 4P-2.0-90D | 4P-2.0-90D | S1 | 16MHZ | 22pF | 10k | C4 | Y1 | C3 | Q2 | JP1 | C1 | C2 | R15 | J1 | Q6 | J2 | REG1117 | 22pF | JP6 | R2 | 47k | R6 | U1 | .1uF | 10uF | Q7 | 47k | JP4 | R7 | 47k | Q10 | R10 | JP3 | JP10 | 47k | IC3 | Q8 | 10k | 3.3k | J12 | R8 | 4028D | IC1 | Q1 | R16 | R17 | 47k | R1 | Q4 | 170 | R4 | Q3 | 47k | R3 | 10k | R19 | AVR_SPI_PRG_62X3_LOCK | 47k | Q9 | R9 | 47k | Q5 | JP9 | R12 | R13 | R5 | R18 | Q12 | 47k | 47k | 47k | JP5 | 47k | R11 | 47k | R14 | JP2 | Q11 | 47k
_tsilk: TX | D7 | XTL2 | B0 | S1 | RX | SDA | SCL | B1 | R15 | C3 | Y1 | B2 | C1 | U1 | C4 | + | INX | R6 | Q6 | O1 | C2 | R2 | 1 | O2 | - | 9V IN | Q2 | R7 | Q7 | 2 | + | O3 | R10 | Q10 | 3 | O4 | - | 9V OUT | IC3 | 4 | O5 | R8 | Q8 | GND | 5V | MOSI | GND | 170V CTRL | IC1 | O6 | R17 | R1 | Q1 | 5V | R16 | R4 | O7 | Q4 | 9V | R19 | MISO | R3 | Q3 | O8 | R18 | SCK | RST | 170V | R9 | R5 | O9 | Q9 | Q5 | + | R12 | Q11 | R13 | O10 | 170V | - | R11 | Q12 | R14 | 170V
_bsilk: Nixie Main / Controller Board / v0.2.3